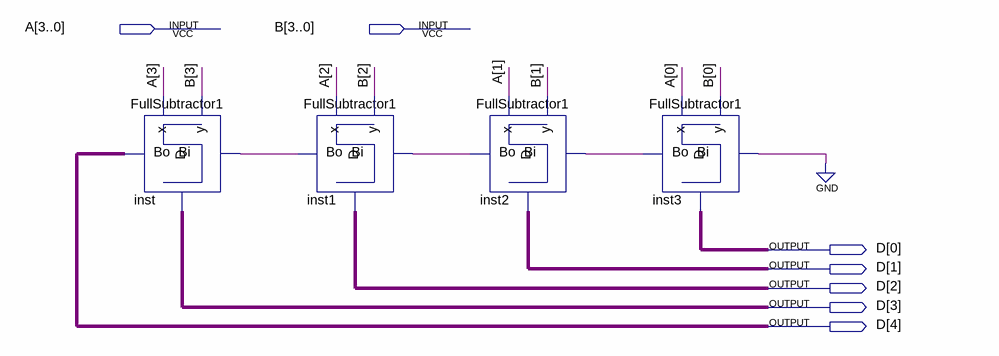
[diagram p0: schematic sheet]
// Quartus schematic FS4.bdf as structural Verilog: 4 symbols, 7 pins
module FS4 (
  input  [3:0] A,
  input  [3:0] B,
  output [4:0] D
);

  wire inst1_bo, inst2_bo, inst3_bo;

  FullSubtractor1 inst (.Bi(inst1_bo), .x(A[3]), .y(B[3]), .D(D[3]), .Bo(D[4]));
  FullSubtractor1 inst1 (.Bi(inst2_bo), .x(A[2]), .y(B[2]), .D(D[2]), .Bo(inst1_bo));
  FullSubtractor1 inst2 (.Bi(inst3_bo), .x(A[1]), .y(B[1]), .D(D[1]), .Bo(inst2_bo));
  FullSubtractor1 inst3 (.Bi(1'b0), .x(A[0]), .y(B[0]), .D(D[0]), .Bo(inst3_bo));
endmodule
